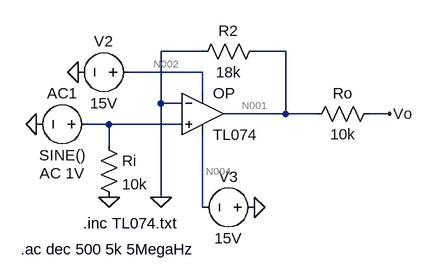
[diagram p0: schematic 4_2_1_c.asc]
4_2_1_c.asc, the LTspice schematic file:
Version 4
SHEET 1 880 680
WIRE 256 32 192 32
WIRE 384 32 336 32
WIRE 256 64 144 64
WIRE 256 96 256 64
WIRE 192 112 192 32
WIRE 224 112 192 112
WIRE 384 128 384 32
WIRE 384 128 288 128
WIRE 432 128 384 128
WIRE 544 128 512 128
WIRE 112 144 80 144
WIRE 224 144 112 144
WIRE 112 176 112 144
WIRE 192 256 192 112
WIRE 256 272 256 160
FLAG 192 256 0
FLAG 112 256 0
FLAG 336 272 0
FLAG 64 64 0
FLAG 0 144 0
FLAG 544 128 Vo
SYMBOL res 352 16 R90
WINDOW 0 0 56 VBottom 2
WINDOW 3 32 56 VTop 2
SYMATTR InstName R2
SYMATTR Value 18k
SYMBOL res 96 160 R0
SYMATTR InstName Ri
SYMATTR Value 10k
SYMBOL res 528 112 R90
WINDOW 0 0 56 VBottom 2
WINDOW 3 32 56 VTop 2
SYMATTR InstName Ro
SYMATTR Value 10k
SYMBOL voltage 96 144 R90
WINDOW 0 -32 56 VBottom 2
WINDOW 3 32 56 VTop 2
WINDOW 123 60 56 VTop 2
WINDOW 39 0 0 Left 0
SYMATTR InstName AC1
SYMATTR Value SINE()
SYMATTR Value2 AC 1V
SYMBOL voltage 160 64 R90
WINDOW 0 -32 56 VBottom 2
WINDOW 3 32 56 VTop 2
SYMATTR InstName V2
SYMATTR Value 15V
SYMBOL voltage 352 272 R90
WINDOW 0 -32 56 VBottom 2
WINDOW 3 32 56 VTop 2
SYMATTR InstName V3
SYMATTR Value 15V
SYMBOL Opamps\\opamp2 256 64 R0
SYMATTR InstName OP
SYMATTR Value TL074
TEXT 72 296 Left 2 !.inc TL074.txt
TEXT -24 336 Left 2 !.ac dec 500 5k 5MegaHz

The netlist it stands for:
* 4_2_1_c.asc
R2 N001 0 18k
Ri N003 0 10k
Ro Vo N001 10k
V§AC1 N003 0 SINE() AC 1V
V2 N002 0 15V
V3 0 N004 15V
XOP N003 0 N002 N004 N001 TL074  ; pins In+ In- V+ V- OUT
.inc TL074.txt
.ac dec 500 5k 5MegaHz
.backanno
.end

* Results of the author's LTspice run, read from the files saved beside the schematic
* Operating Point, zero values left out:
*   V(n001) = 2.476 V
*   V(vo) = 2.476 V
*   V(n002) = 15 V
*   V(n004) = -15 V
*   I(R2) = 137.5 µA
*   I(V3) = -14.19 mA
*   I(V2) = -14.19 mA
*   I(Ac1) = -45.05 pA
*   Ix(op:1) = 45.05 pA
*   Ix(op:2) = 45.05 pA
*   Ix(op:3) = 14.19 mA
*   Ix(op:4) = -14.19 mA
*   Ix(op:5) = -137.5 µA
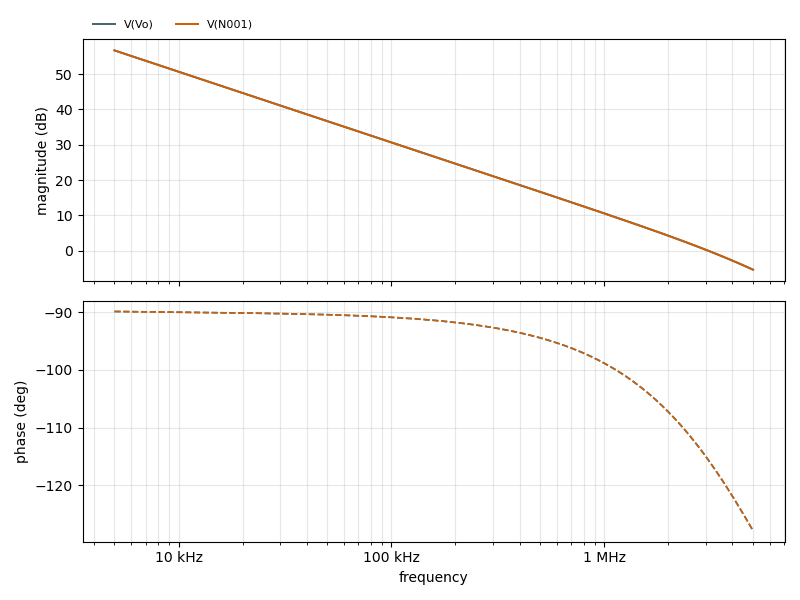
[diagram p1: AC Analysis of 4_2_1_c.asc, plotted from the saved traces]
* AC Analysis, 1 run:
*   V(Vo): 56.70 dB at 5 kHz, -5.36 dB at 5 MHz, peak 56.70 dB at 5 kHz, 3 dB below the peak at 7.071 kHz
*   V(N001): 56.70 dB at 5 kHz, -5.36 dB at 5 MHz, peak 56.70 dB at 5 kHz, 3 dB below the peak at 7.071 kHz